# EAGLE schematic IRis - Master Schematic (EAGLE 8.7.0)
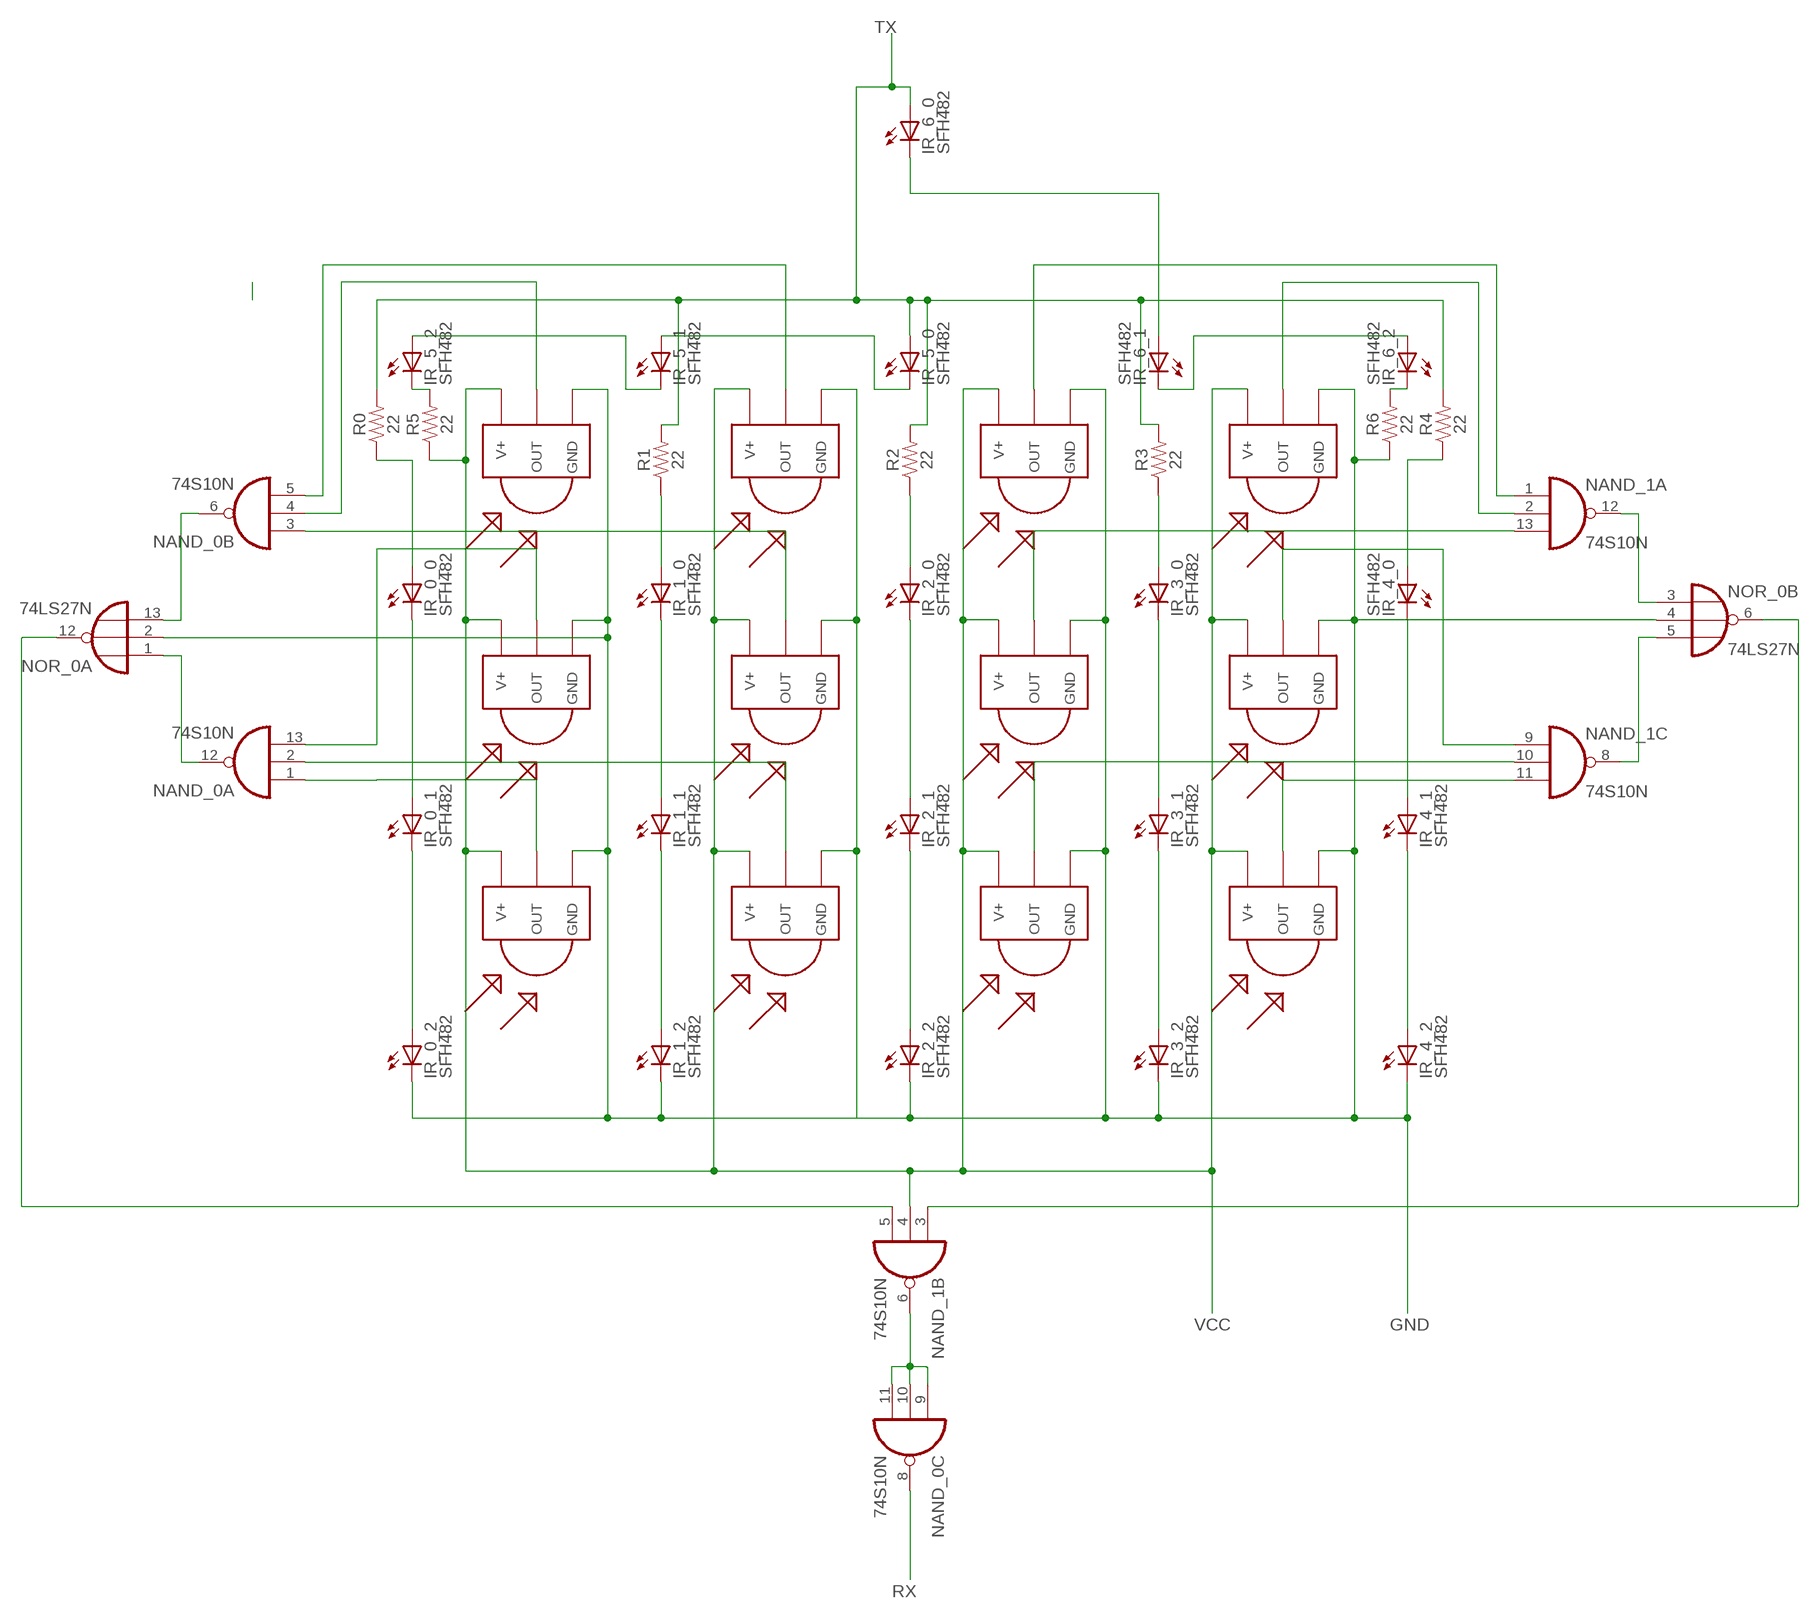
[diagram p0: schematic, sheet 1]

## Parts
IR_0_0  SFH482  [SFH482]
IR_0_1  SFH482  [SFH482]
IR_0_2  SFH482  [SFH482]
IR_1_0  SFH482  [SFH482]
IR_1_1  SFH482  [SFH482]
IR_1_2  SFH482  [SFH482]
IR_2_0  SFH482  [SFH482]
IR_2_1  SFH482  [SFH482]
IR_2_2  SFH482  [SFH482]
IR_3_0  SFH482  [SFH482]
IR_3_1  SFH482  [SFH482]
IR_3_2  SFH482  [SFH482]
IR_4_0  SFH482  [SFH482]
IR_4_1  SFH482  [SFH482]
IR_4_2  SFH482  [SFH482]
IR_5_0  SFH482  [SFH482]
IR_5_1  SFH482  [SFH482]
IR_5_2  SFH482  [SFH482]
IR_6_0  SFH482  [SFH482]
IR_6_1  SFH482  [SFH482]
IR_6_2  SFH482  [SFH482]
IR_RX_0  TSOP1838  [TSOP18XX]
IR_RX_1  TSOP1838  [TSOP18XX]
IR_RX_2  TSOP1838  [TSOP18XX]
IR_RX_3  TSOP1838  [TSOP18XX]
IR_RX_4  TSOP1838  [TSOP18XX]
IR_RX_5  TSOP1838  [TSOP18XX]
IR_RX_6  TSOP1838  [TSOP18XX]
IR_RX_7  TSOP1838  [TSOP18XX]
IR_RX_8  TSOP1838  [TSOP18XX]
IR_RX_9  TSOP1838  [TSOP18XX]
IR_RX_10  TSOP1838  [TSOP18XX]
IR_RX_11  TSOP1838  [TSOP18XX]
NAND_0  74S10N  [DIL14]
NAND_1  74S10N  [DIL14]
NOR_0  74LS27N  [DIL14]
R0  22  22OHM-0402-1/10W-1%  [0402]
R1  22  22OHM-0402-1/10W-1%  [0402]
R2  22  22OHM-0402-1/10W-1%  [0402]
R3  22  22OHM-0402-1/10W-1%  [0402]
R4  22  22OHM-0402-1/10W-1%  [0402]
R5  22  22OHM-0402-1/10W-1%  [0402]
R6  22  22OHM-0402-1/10W-1%  [0402]

## Nets
GND: IR_0_2.K(C) IR_1_2.K(C) IR_2_2.K(C) IR_3_2.K(C) IR_4_2.K(C) IR_RX_0.GND IR_RX_1.GND IR_RX_2.GND IR_RX_3.GND IR_RX_4.GND IR_RX_5.GND IR_RX_6.GND IR_RX_7.GND IR_RX_8.GND IR_RX_9.GND IR_RX_10.GND IR_RX_11.GND NOR_0.2(A:I1) NOR_0.4(B:I1) R6.1
N$1: IR_0_0.K(C) IR_0_1.A
N$2: IR_0_1.K(C) IR_0_2.A
N$3: IR_1_0.K(C) IR_1_1.A
N$4: IR_1_1.K(C) IR_1_2.A
N$5: IR_2_0.K(C) IR_2_1.A
N$6: IR_2_1.K(C) IR_2_2.A
N$7: IR_3_0.K(C) IR_3_1.A
N$8: IR_3_1.K(C) IR_3_2.A
N$9: IR_4_0.K(C) IR_4_1.A
N$10: IR_4_1.K(C) IR_4_2.A
N$11: IR_5_2.K(C) R5.2
N$12: IR_6_2.K(C) R6.2
N$13: IR_0_0.A R0.1
N$14: IR_6_0.K(C) IR_6_1.A
N$15: IR_4_0.A R4.1
N$17: IR_RX_0.OUT NAND_0.13(A:I2)
N$18: IR_RX_1.OUT NAND_0.1(A:I0)
N$20: IR_5_0.K(C) IR_5_1.A
N$21: IR_5_1.K(C) IR_5_2.A
N$22: IR_6_1.K(C) IR_6_2.A
N$23: IR_RX_4.OUT NAND_0.2(A:I1)
N$24: IR_1_0.A R1.1
N$25: IR_2_0.A R2.1
N$26: IR_3_0.A R3.1
N$27: IR_RX_3.OUT NAND_0.3(B:I0)
N$28: IR_RX_2.OUT NAND_0.4(B:I1)
N$30: IR_RX_5.OUT NAND_0.5(B:I2)
N$31: IR_RX_6.OUT NAND_1.13(A:I2)
N$32: IR_RX_11.OUT NAND_1.2(A:I1)
N$33: IR_RX_8.OUT NAND_1.1(A:I0)
N$34: IR_RX_10.OUT NAND_1.11(C:I2)
N$35: IR_RX_7.OUT NAND_1.10(C:I1)
N$36: IR_RX_9.OUT NAND_1.9(C:I0)
N$37: NAND_0.6(B:O) NOR_0.13(A:I2)
N$38: NAND_0.12(A:O) NOR_0.1(A:I0)
N$39: NAND_1.12(A:O) NOR_0.3(B:I0)
N$40: NAND_1.8(C:O) NOR_0.5(B:I2)
N$41: NAND_1.3(B:I0) NOR_0.6(B:O)
N$42: NAND_1.5(B:I2) NOR_0.12(A:O)
N$44: NAND_0.9(C:I0) NAND_0.10(C:I1) NAND_0.11(C:I2) NAND_1.6(B:O)
RX: NAND_0.8(C:O)
TX: IR_5_0.A IR_6_0.A R0.2 R1.2 R2.2 R3.2 R4.2
VCC: IR_RX_0.VCC(V+) IR_RX_1.VCC(V+) IR_RX_2.VCC(V+) IR_RX_3.VCC(V+) IR_RX_4.VCC(V+) IR_RX_5.VCC(V+) IR_RX_6.VCC(V+) IR_RX_7.VCC(V+) IR_RX_8.VCC(V+) IR_RX_9.VCC(V+) IR_RX_10.VCC(V+) IR_RX_11.VCC(V+) NAND_1.4(B:I1) R5.1
Unconnected: NOR_0.8(C:O) NOR_0.9(C:I0) NOR_0.10(C:I1) NOR_0.11(C:I2)

## Power pins joined to a net without a drawn wire
GND: NAND_0.7(P:GND) NAND_1.7(P:GND) NOR_0.7(P:GND)
VCC: NAND_0.14(P:VCC) NAND_1.14(P:VCC) NOR_0.14(P:VCC)

## Library data of the parts
IR_0_0 IR_0_1 IR_0_2 IR_1_0 IR_1_1 IR_1_2 IR_2_0 IR_2_1 IR_2_2 IR_3_0 IR_3_1 IR_3_2 IR_4_0 IR_4_1 IR_4_2 IR_5_0 IR_5_1 IR_5_2 IR_6_0 IR_6_1 IR_6_2 = led:SFH482: IR LED infrared emitting diode, Infineon
IR_RX_0 IR_RX_1-IR_RX_11 = tsop:TSOP1838: IR Receiver and Demodulator
NAND_0 NAND_1 = 74xx-eu:74*10: Triple 3-input NAND gate
NOR_0 = 74xx-eu:74*27: Triple 3-input NOR gate
R0 R1-R6 = SparkFun-Resistors:22OHM: 22Ω resistor A resistor is a passive two-terminal electrical component that implements electrical resistance as a circuit element. Resistors act to reduce current flow, and, at the same time, act to lower voltage levels within circuits. - Wikipedia; PROD_ID: RES-12427